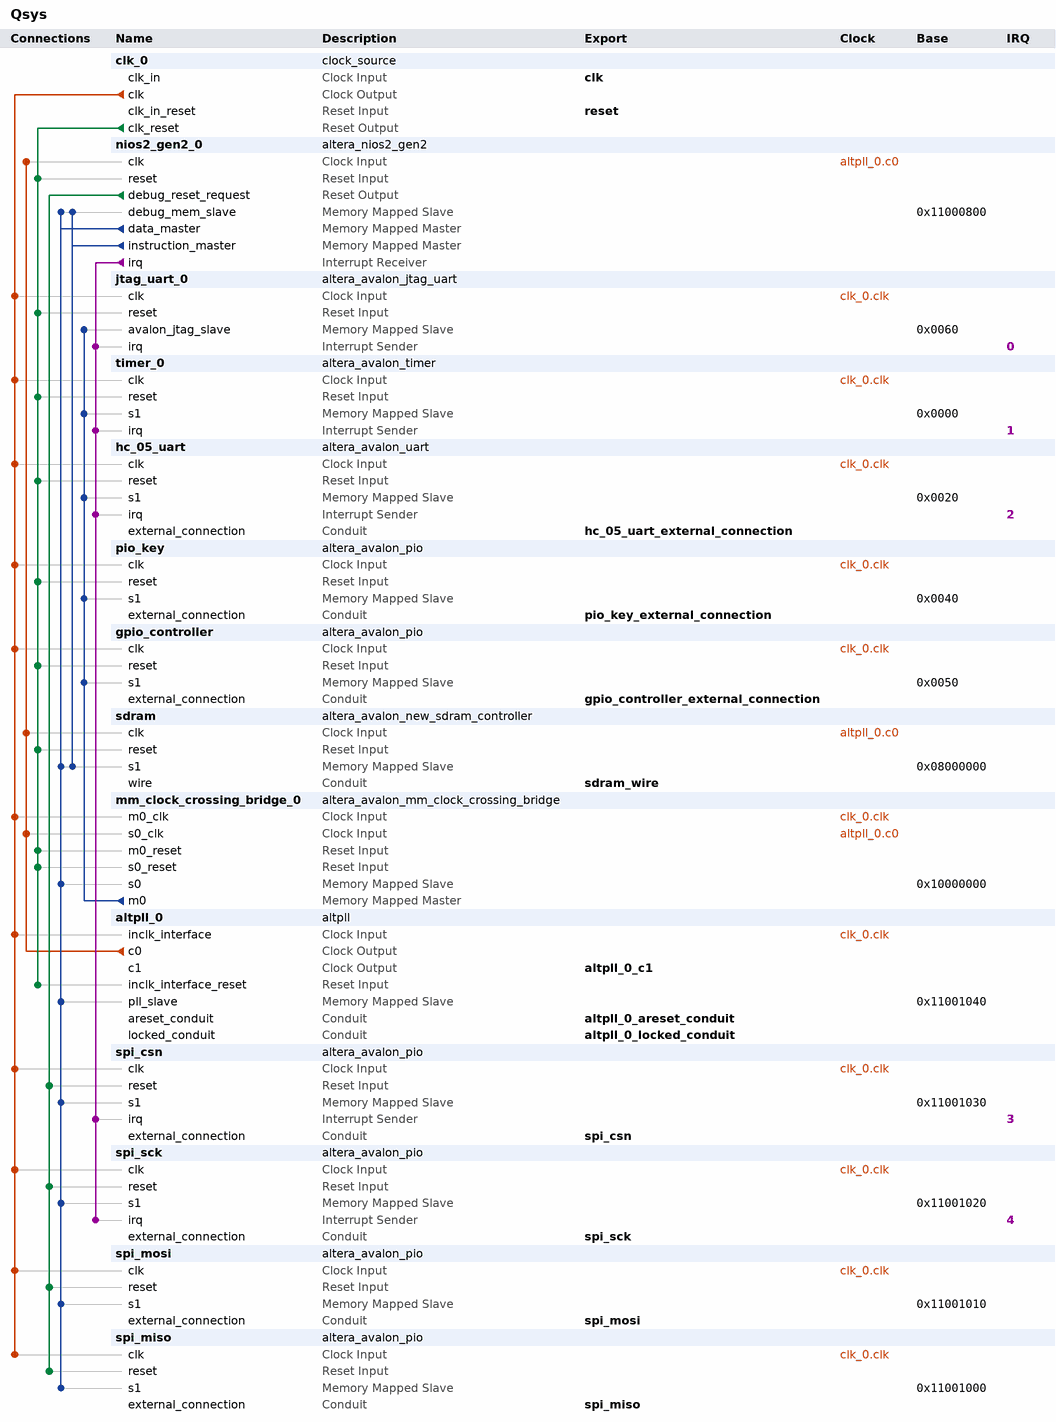
[diagram p0: system contents]
# Platform Designer (Qsys) system Qsys, Cyclone IV E EP4CE115F29C7
# Parameters at their usual value, and those the tool derives, are not listed.
package require -exact qsys 16.1
create_system Qsys
set_project_property DEVICE_FAMILY {Cyclone IV E}
set_project_property DEVICE EP4CE115F29C7

add_instance clk_0 clock_source 16.1
set_instance_parameter_value clk_0 clockFrequency 50000000

add_instance nios2_gen2_0 altera_nios2_gen2 16.1
set_instance_parameter_value nios2_gen2_0 dcache_size 2048
set_instance_parameter_value nios2_gen2_0 exceptionSlave sdram.s1
set_instance_parameter_value nios2_gen2_0 icache_size 4096
set_instance_parameter_value nios2_gen2_0 impl Fast
set_instance_parameter_value nios2_gen2_0 resetSlave sdram.s1

add_instance jtag_uart_0 altera_avalon_jtag_uart 16.1
set_instance_parameter_value jtag_uart_0 simInteractiveOptions NO_INTERACTIVE_WINDOWS

add_instance timer_0 altera_avalon_timer 16.1
set_instance_parameter_value timer_0 period 1
set_instance_parameter_value timer_0 periodUnits MSEC

add_instance hc_05_uart altera_avalon_uart 16.1
set_instance_parameter_value hc_05_uart baud 38400
set_instance_parameter_value hc_05_uart dataBits 8
set_instance_parameter_value hc_05_uart fixedBaud false
set_instance_parameter_value hc_05_uart parity NONE
set_instance_parameter_value hc_05_uart stopBits 1

add_instance pio_key altera_avalon_pio 16.1
set_instance_parameter_value pio_key direction Input
set_instance_parameter_value pio_key width 1

add_instance gpio_controller altera_avalon_pio 16.1
set_instance_parameter_value gpio_controller direction Output
set_instance_parameter_value gpio_controller width 1

add_instance sdram altera_avalon_new_sdram_controller 16.1
set_instance_parameter_value sdram TAC 5.4
set_instance_parameter_value sdram TRCD 15.0
set_instance_parameter_value sdram TRP 15.0
set_instance_parameter_value sdram casLatency 3
set_instance_parameter_value sdram columnWidth 10
set_instance_parameter_value sdram dataWidth 32
set_instance_parameter_value sdram generateSimulationModel false
set_instance_parameter_value sdram model single_Micron_MT48LC4M32B2_7_chip
set_instance_parameter_value sdram numberOfBanks 4
set_instance_parameter_value sdram numberOfChipSelects 1
set_instance_parameter_value sdram powerUpDelay 100.0
set_instance_parameter_value sdram refreshPeriod 7.8125
set_instance_parameter_value sdram rowWidth 13

add_instance mm_clock_crossing_bridge_0 altera_avalon_mm_clock_crossing_bridge 16.1
set_instance_parameter_value mm_clock_crossing_bridge_0 ADDRESS_WIDTH 10
set_instance_parameter_value mm_clock_crossing_bridge_0 COMMAND_FIFO_DEPTH 8
set_instance_parameter_value mm_clock_crossing_bridge_0 DATA_WIDTH 32
set_instance_parameter_value mm_clock_crossing_bridge_0 MASTER_SYNC_DEPTH 2
set_instance_parameter_value mm_clock_crossing_bridge_0 MAX_BURST_SIZE 1
set_instance_parameter_value mm_clock_crossing_bridge_0 RESPONSE_FIFO_DEPTH 8
set_instance_parameter_value mm_clock_crossing_bridge_0 SLAVE_SYNC_DEPTH 2
set_instance_parameter_value mm_clock_crossing_bridge_0 USE_AUTO_ADDRESS_WIDTH 0

add_instance altpll_0 altpll 16.1
set_instance_parameter_value altpll_0 CLK0_DIVIDE_BY 1
set_instance_parameter_value altpll_0 CLK0_MULTIPLY_BY 2
set_instance_parameter_value altpll_0 CLK1_DIVIDE_BY 1
set_instance_parameter_value altpll_0 CLK1_DUTY_CYCLE 50
set_instance_parameter_value altpll_0 CLK1_MULTIPLY_BY 2
set_instance_parameter_value altpll_0 CLK1_PHASE_SHIFT -1806
set_instance_parameter_value altpll_0 INCLK0_INPUT_FREQUENCY 20000
set_instance_parameter_value altpll_0 PORT_ARESET PORT_USED
set_instance_parameter_value altpll_0 PORT_LOCKED PORT_USED
set_instance_parameter_value altpll_0 PORT_clk1 PORT_USED
set_instance_parameter_value altpll_0 PORT_clk2 PORT_UNUSED
set_instance_parameter_value altpll_0 PORT_clk3 PORT_UNUSED

add_instance spi_csn altera_avalon_pio 16.1
set_instance_parameter_value spi_csn direction Input
set_instance_parameter_value spi_csn generateIRQ true
set_instance_parameter_value spi_csn width 1

add_instance spi_sck altera_avalon_pio 16.1
set_instance_parameter_value spi_sck direction Input
set_instance_parameter_value spi_sck generateIRQ true
set_instance_parameter_value spi_sck width 1

add_instance spi_mosi altera_avalon_pio 16.1
set_instance_parameter_value spi_mosi direction Input
set_instance_parameter_value spi_mosi width 1

add_instance spi_miso altera_avalon_pio 16.1
set_instance_parameter_value spi_miso direction Output
set_instance_parameter_value spi_miso width 1

# connections
add_connection altpll_0.c0 mm_clock_crossing_bridge_0.s0_clk clock
add_connection altpll_0.c0 nios2_gen2_0.clk clock
add_connection altpll_0.c0 sdram.clk clock
add_connection clk_0.clk altpll_0.inclk_interface clock
add_connection clk_0.clk gpio_controller.clk clock
add_connection clk_0.clk hc_05_uart.clk clock
add_connection clk_0.clk jtag_uart_0.clk clock
add_connection clk_0.clk mm_clock_crossing_bridge_0.m0_clk clock
add_connection clk_0.clk pio_key.clk clock
add_connection clk_0.clk spi_csn.clk clock
add_connection clk_0.clk spi_miso.clk clock
add_connection clk_0.clk spi_mosi.clk clock
add_connection clk_0.clk spi_sck.clk clock
add_connection clk_0.clk timer_0.clk clock
add_connection clk_0.clk_reset altpll_0.inclk_interface_reset reset
add_connection clk_0.clk_reset gpio_controller.reset reset
add_connection clk_0.clk_reset hc_05_uart.reset reset
add_connection clk_0.clk_reset jtag_uart_0.reset reset
add_connection clk_0.clk_reset mm_clock_crossing_bridge_0.m0_reset reset
add_connection clk_0.clk_reset mm_clock_crossing_bridge_0.s0_reset reset
add_connection clk_0.clk_reset nios2_gen2_0.reset reset
add_connection clk_0.clk_reset pio_key.reset reset
add_connection clk_0.clk_reset sdram.reset reset
add_connection clk_0.clk_reset timer_0.reset reset
add_connection nios2_gen2_0.debug_reset_request spi_csn.reset reset
add_connection nios2_gen2_0.debug_reset_request spi_miso.reset reset
add_connection nios2_gen2_0.debug_reset_request spi_mosi.reset reset
add_connection nios2_gen2_0.debug_reset_request spi_sck.reset reset
add_connection mm_clock_crossing_bridge_0.m0 gpio_controller.s1 avalon
set_connection_parameter_value mm_clock_crossing_bridge_0.m0/gpio_controller.s1 baseAddress 0x0050
add_connection mm_clock_crossing_bridge_0.m0 hc_05_uart.s1 avalon
set_connection_parameter_value mm_clock_crossing_bridge_0.m0/hc_05_uart.s1 baseAddress 0x0020
add_connection mm_clock_crossing_bridge_0.m0 jtag_uart_0.avalon_jtag_slave avalon
set_connection_parameter_value mm_clock_crossing_bridge_0.m0/jtag_uart_0.avalon_jtag_slave baseAddress 0x0060
add_connection mm_clock_crossing_bridge_0.m0 pio_key.s1 avalon
set_connection_parameter_value mm_clock_crossing_bridge_0.m0/pio_key.s1 baseAddress 0x0040
add_connection mm_clock_crossing_bridge_0.m0 timer_0.s1 avalon
set_connection_parameter_value mm_clock_crossing_bridge_0.m0/timer_0.s1 baseAddress 0x0000
add_connection nios2_gen2_0.data_master altpll_0.pll_slave avalon
set_connection_parameter_value nios2_gen2_0.data_master/altpll_0.pll_slave baseAddress 0x11001040
add_connection nios2_gen2_0.data_master mm_clock_crossing_bridge_0.s0 avalon
set_connection_parameter_value nios2_gen2_0.data_master/mm_clock_crossing_bridge_0.s0 baseAddress 0x10000000
add_connection nios2_gen2_0.data_master nios2_gen2_0.debug_mem_slave avalon
set_connection_parameter_value nios2_gen2_0.data_master/nios2_gen2_0.debug_mem_slave baseAddress 0x11000800
add_connection nios2_gen2_0.data_master sdram.s1 avalon
set_connection_parameter_value nios2_gen2_0.data_master/sdram.s1 baseAddress 0x08000000
add_connection nios2_gen2_0.data_master spi_csn.s1 avalon
set_connection_parameter_value nios2_gen2_0.data_master/spi_csn.s1 baseAddress 0x11001030
add_connection nios2_gen2_0.data_master spi_miso.s1 avalon
set_connection_parameter_value nios2_gen2_0.data_master/spi_miso.s1 baseAddress 0x11001000
add_connection nios2_gen2_0.data_master spi_mosi.s1 avalon
set_connection_parameter_value nios2_gen2_0.data_master/spi_mosi.s1 baseAddress 0x11001010
add_connection nios2_gen2_0.data_master spi_sck.s1 avalon
set_connection_parameter_value nios2_gen2_0.data_master/spi_sck.s1 baseAddress 0x11001020
add_connection nios2_gen2_0.instruction_master nios2_gen2_0.debug_mem_slave avalon
set_connection_parameter_value nios2_gen2_0.instruction_master/nios2_gen2_0.debug_mem_slave baseAddress 0x11000800
add_connection nios2_gen2_0.instruction_master sdram.s1 avalon
set_connection_parameter_value nios2_gen2_0.instruction_master/sdram.s1 baseAddress 0x08000000
add_connection nios2_gen2_0.irq hc_05_uart.irq interrupt
set_connection_parameter_value nios2_gen2_0.irq/hc_05_uart.irq irqNumber 2
add_connection nios2_gen2_0.irq jtag_uart_0.irq interrupt
set_connection_parameter_value nios2_gen2_0.irq/jtag_uart_0.irq irqNumber 0
add_connection nios2_gen2_0.irq spi_csn.irq interrupt
set_connection_parameter_value nios2_gen2_0.irq/spi_csn.irq irqNumber 3
add_connection nios2_gen2_0.irq spi_sck.irq interrupt
set_connection_parameter_value nios2_gen2_0.irq/spi_sck.irq irqNumber 4
add_connection nios2_gen2_0.irq timer_0.irq interrupt
set_connection_parameter_value nios2_gen2_0.irq/timer_0.irq irqNumber 1

# exported interfaces
add_interface altpll_0_areset_conduit conduit end
set_interface_property altpll_0_areset_conduit EXPORT_OF altpll_0.areset_conduit
add_interface altpll_0_c1 clock source
set_interface_property altpll_0_c1 EXPORT_OF altpll_0.c1
add_interface altpll_0_locked_conduit conduit end
set_interface_property altpll_0_locked_conduit EXPORT_OF altpll_0.locked_conduit
add_interface clk clock sink
set_interface_property clk EXPORT_OF clk_0.clk_in
add_interface gpio_controller_external_connection conduit end
set_interface_property gpio_controller_external_connection EXPORT_OF gpio_controller.external_connection
add_interface hc_05_uart_external_connection conduit end
set_interface_property hc_05_uart_external_connection EXPORT_OF hc_05_uart.external_connection
add_interface pio_key_external_connection conduit end
set_interface_property pio_key_external_connection EXPORT_OF pio_key.external_connection
add_interface reset reset sink
set_interface_property reset EXPORT_OF clk_0.clk_in_reset
add_interface sdram_wire conduit end
set_interface_property sdram_wire EXPORT_OF sdram.wire
add_interface spi_csn conduit end
set_interface_property spi_csn EXPORT_OF spi_csn.external_connection
add_interface spi_miso conduit end
set_interface_property spi_miso EXPORT_OF spi_miso.external_connection
add_interface spi_mosi conduit end
set_interface_property spi_mosi EXPORT_OF spi_mosi.external_connection
add_interface spi_sck conduit end
set_interface_property spi_sck EXPORT_OF spi_sck.external_connection

set_interconnect_requirement {$system} qsys_mm.clockCrossingAdapter HANDSHAKE
set_interconnect_requirement {$system} qsys_mm.enableEccProtection FALSE
set_interconnect_requirement {$system} qsys_mm.insertDefaultSlave FALSE
set_interconnect_requirement {$system} qsys_mm.maxAdditionalLatency 1

save_system Qsys.qsys
